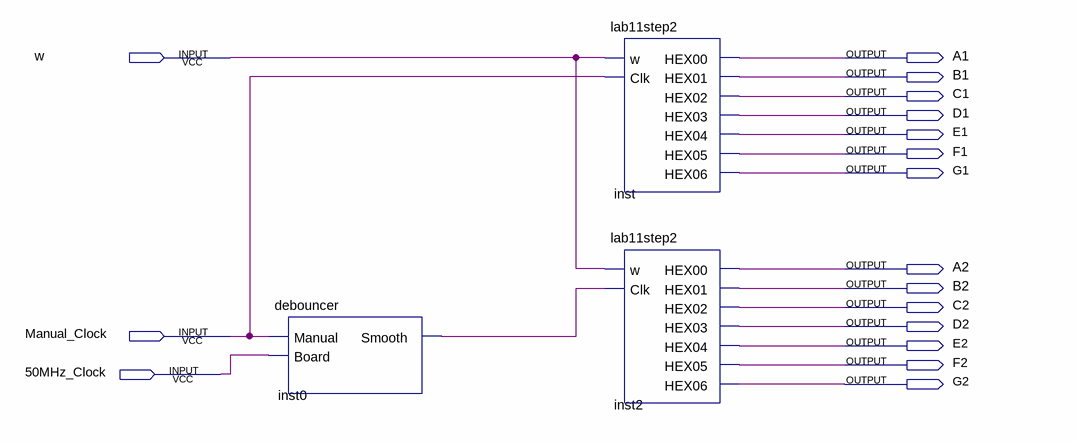
[diagram p0: schematic sheet]
// Quartus schematic lab11step3.bdf as structural Verilog: 3 symbols, 17 pins
module lab11step3 (
  input  w,
  input  Manual_Clock,
  input  \50MHz_Clock ,
  output A1,
  output B1,
  output C1,
  output D1,
  output E1,
  output F1,
  output G1,
  output A2,
  output B2,
  output C2,
  output D2,
  output E2,
  output F2,
  output G2
);

  wire inst0_smooth;

  debouncer inst0 (.Manual(Manual_Clock), .Board(\50MHz_Clock ), .Smooth(inst0_smooth));
  lab11step2 inst (
    .w(w), .Clk(Manual_Clock), .HEX00(A1), .HEX01(B1), .HEX02(C1), .HEX03(D1), .HEX04(E1), .HEX05(F1),
    .HEX06(G1));
  lab11step2 inst2 (
    .w(w), .Clk(inst0_smooth), .HEX00(A2), .HEX01(B2), .HEX02(C2), .HEX03(D2), .HEX04(E2), .HEX05(F2),
    .HEX06(G2));
endmodule
